# Altium schematic sheet hiiri627v071_ssop.SchDoc: hiiri627v07
size A3; Date: 31.05.2020 0:45:57; SheetNumber: 1; GateName_1: G$1; SymbolName_1: A5L-LOC; LibraryName: frames; DeviceSetName: DINA5_L; A: A; B: B; C: C; 1: 1; 2: 2; 3: 3; 4: 4; Sheet: Sheet:
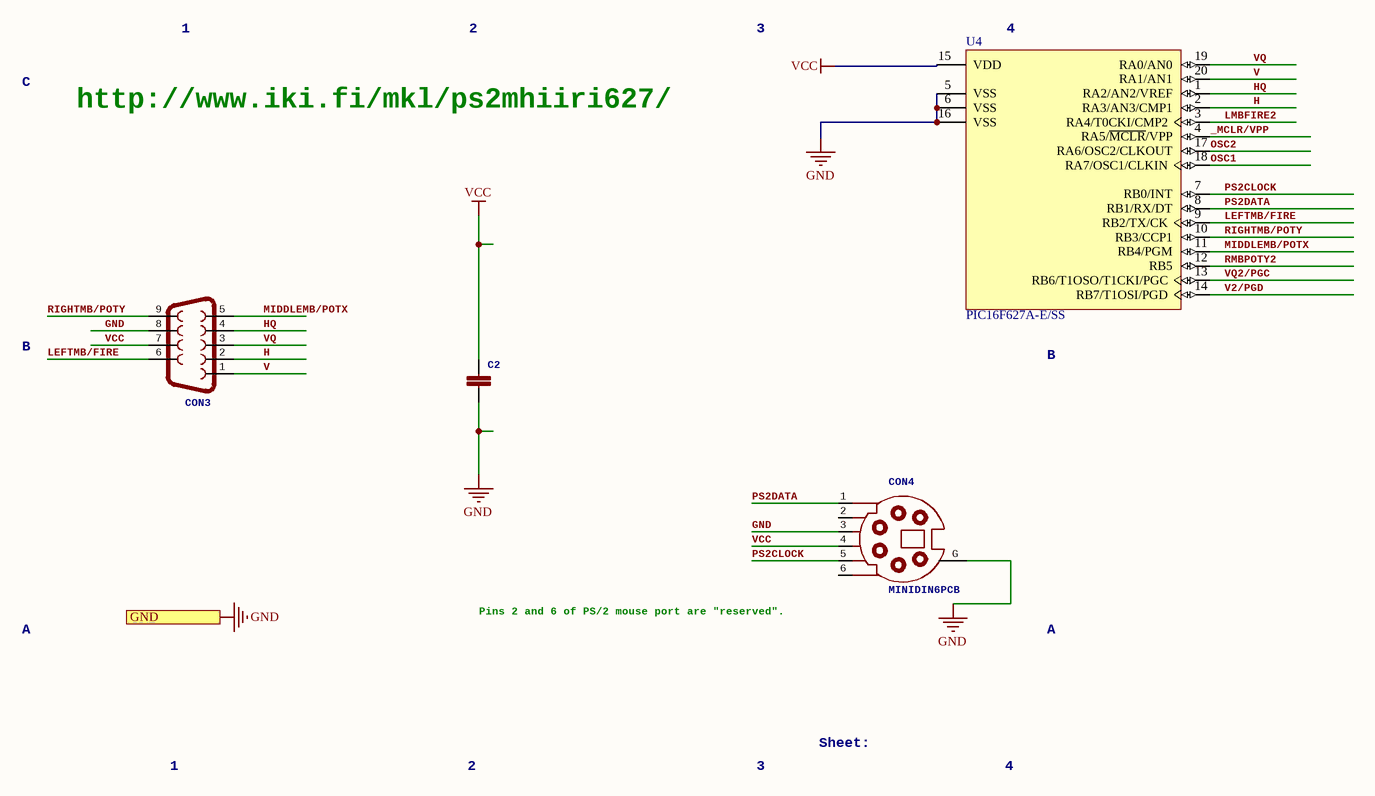
[diagram p0: hiiri627v071_ssop.SchDoc]

## Parts
C2  C-EUC0805K  [C0805K]  (value not drawn)
CON3  F09D  [F09D]  (value not drawn)
CON4  MINIDIN6PCB  [MINIDIN6PCB]
U4  PIC16F627A-E/SS  [SSOP-SS20_N]

## Ports
GND

## Nets
GND: C2.2 CON3.8 CON4.3 CON4.G U4.5(VSS) U4.6(VSS) U4.16(VSS) ; port GND
VCC: C2.1 CON3.7 CON4.4 U4.15(VDD)
_MCLR/VPP: U4.4(RA5/~{MCLR}/VPP)
H: CON3.2 U4.2(RA3/AN3/CMP1)
HQ: CON3.4 U4.1(RA2/AN2/VREF)
LEFTMB/FIRE: CON3.6 U4.9(RB2/TX/CK)
LMBFIRE2: U4.3(RA4/T0CKI/CMP2)
MIDDLEMB/POTX: CON3.5 U4.11(RB4/PGM)
OSC1: U4.18(RA7/OSC1/CLKIN)
OSC2: U4.17(RA6/OSC2/CLKOUT)
PS2CLOCK: CON4.5 U4.7(RB0/INT)
PS2DATA: CON4.1 U4.8(RB1/RX/DT)
RIGHTMB/POTY: CON3.9 U4.10(RB3/CCP1)
RMBPOTY2: U4.12(RB5)
V: CON3.1 U4.20(RA1/AN1)
V2/PGD: U4.14(RB7/T1OSI/PGD)
VQ: CON3.3 U4.19(RA0/AN0)
VQ2/PGC: U4.13(RB6/T1OSO/T1CKI/PGC)

Not connected (* = marked no-connect by the designer): CON4 2 6

## Notes on the sheet
- 1
- 2
- 3
- (near U4) 4
- C
- http://www.iki.fi/mkl/ps2mhiiri627/
- (near U4) C
- B
- (near U4) B
- A
- Pins 2 and 6 of PS/2 mouse port are "reserved".
- Sheet:
- 4
- Title
- Size:
- Date:
- A3
- Number:
- Time:
- Revision:
- Sheet
- of
- File:

## Library data of the parts
C2 = C-EUC0805K: CAPACITOR, European symbol; GateName_1: G$1; SymbolName_1: C-EU; DeviceName: C0805K; LibraryName: rcl; DeviceSetName: C-EU
CON3 = F09D: SUB-D; GateName_1: G$1; SymbolName_1: F09; DeviceName: D; LibraryName: con-subd; DeviceSetName: F09
CON4 = MINIDIN6PCB: GateName_1: G$1; SymbolName_1: MINIDIN6PCB_SYM; LibraryName: 0mikacon; DeviceSetName: MINIDIN6PCB
U4 = PIC16F627A-E/SS: FLASH-Based 8-Bit CMOS Microcontroller with nanoWatt Technology, 1K (x14-Bit words) FLASH, 224 Bytes SRAM, 20-Pin SSOP, 3.0 to 5.5V Supply Range, Extended Temperature; Published: 11-Oct-2004; LatestRevisionDate: 29-Jan-2009; LatestRevisionNote: Sch. layout revised. 3D Model Removed.; DatasheetVersion: revF, Mar-2007; PackageVersion: revBB, Aug-2009; PackageReference: SSOP-SS20; Publisher: Altium Limited; PackageDescription: 20-Lead Plastic Shrink Small Outline (SS) - 5.3mm Body [SSOP]; Supplier 1: Digi-Key; Supplier Part Number 1: PIC16F627A-E/SS-ND; Code_JEDEC: MO-150; Code_IPC: SOP65P780-20; ComponentLink1Description: Datasheet; ComponentLink1URL: http://ww1.microchip.com/downloads/en/DeviceDoc/40044F.pdf; ComponentLink2Description: Packaging Specification; ComponentLink2URL: http://www.microchip.com/stellent/groups/techpub_sg/documents/packagingspec/en012702.pdf; ComponentLink3Description: Microchip.com Home; ComponentLink3URL: http://www.microchip.com/